# EAGLE design Nav (EAGLE 9.6.2)
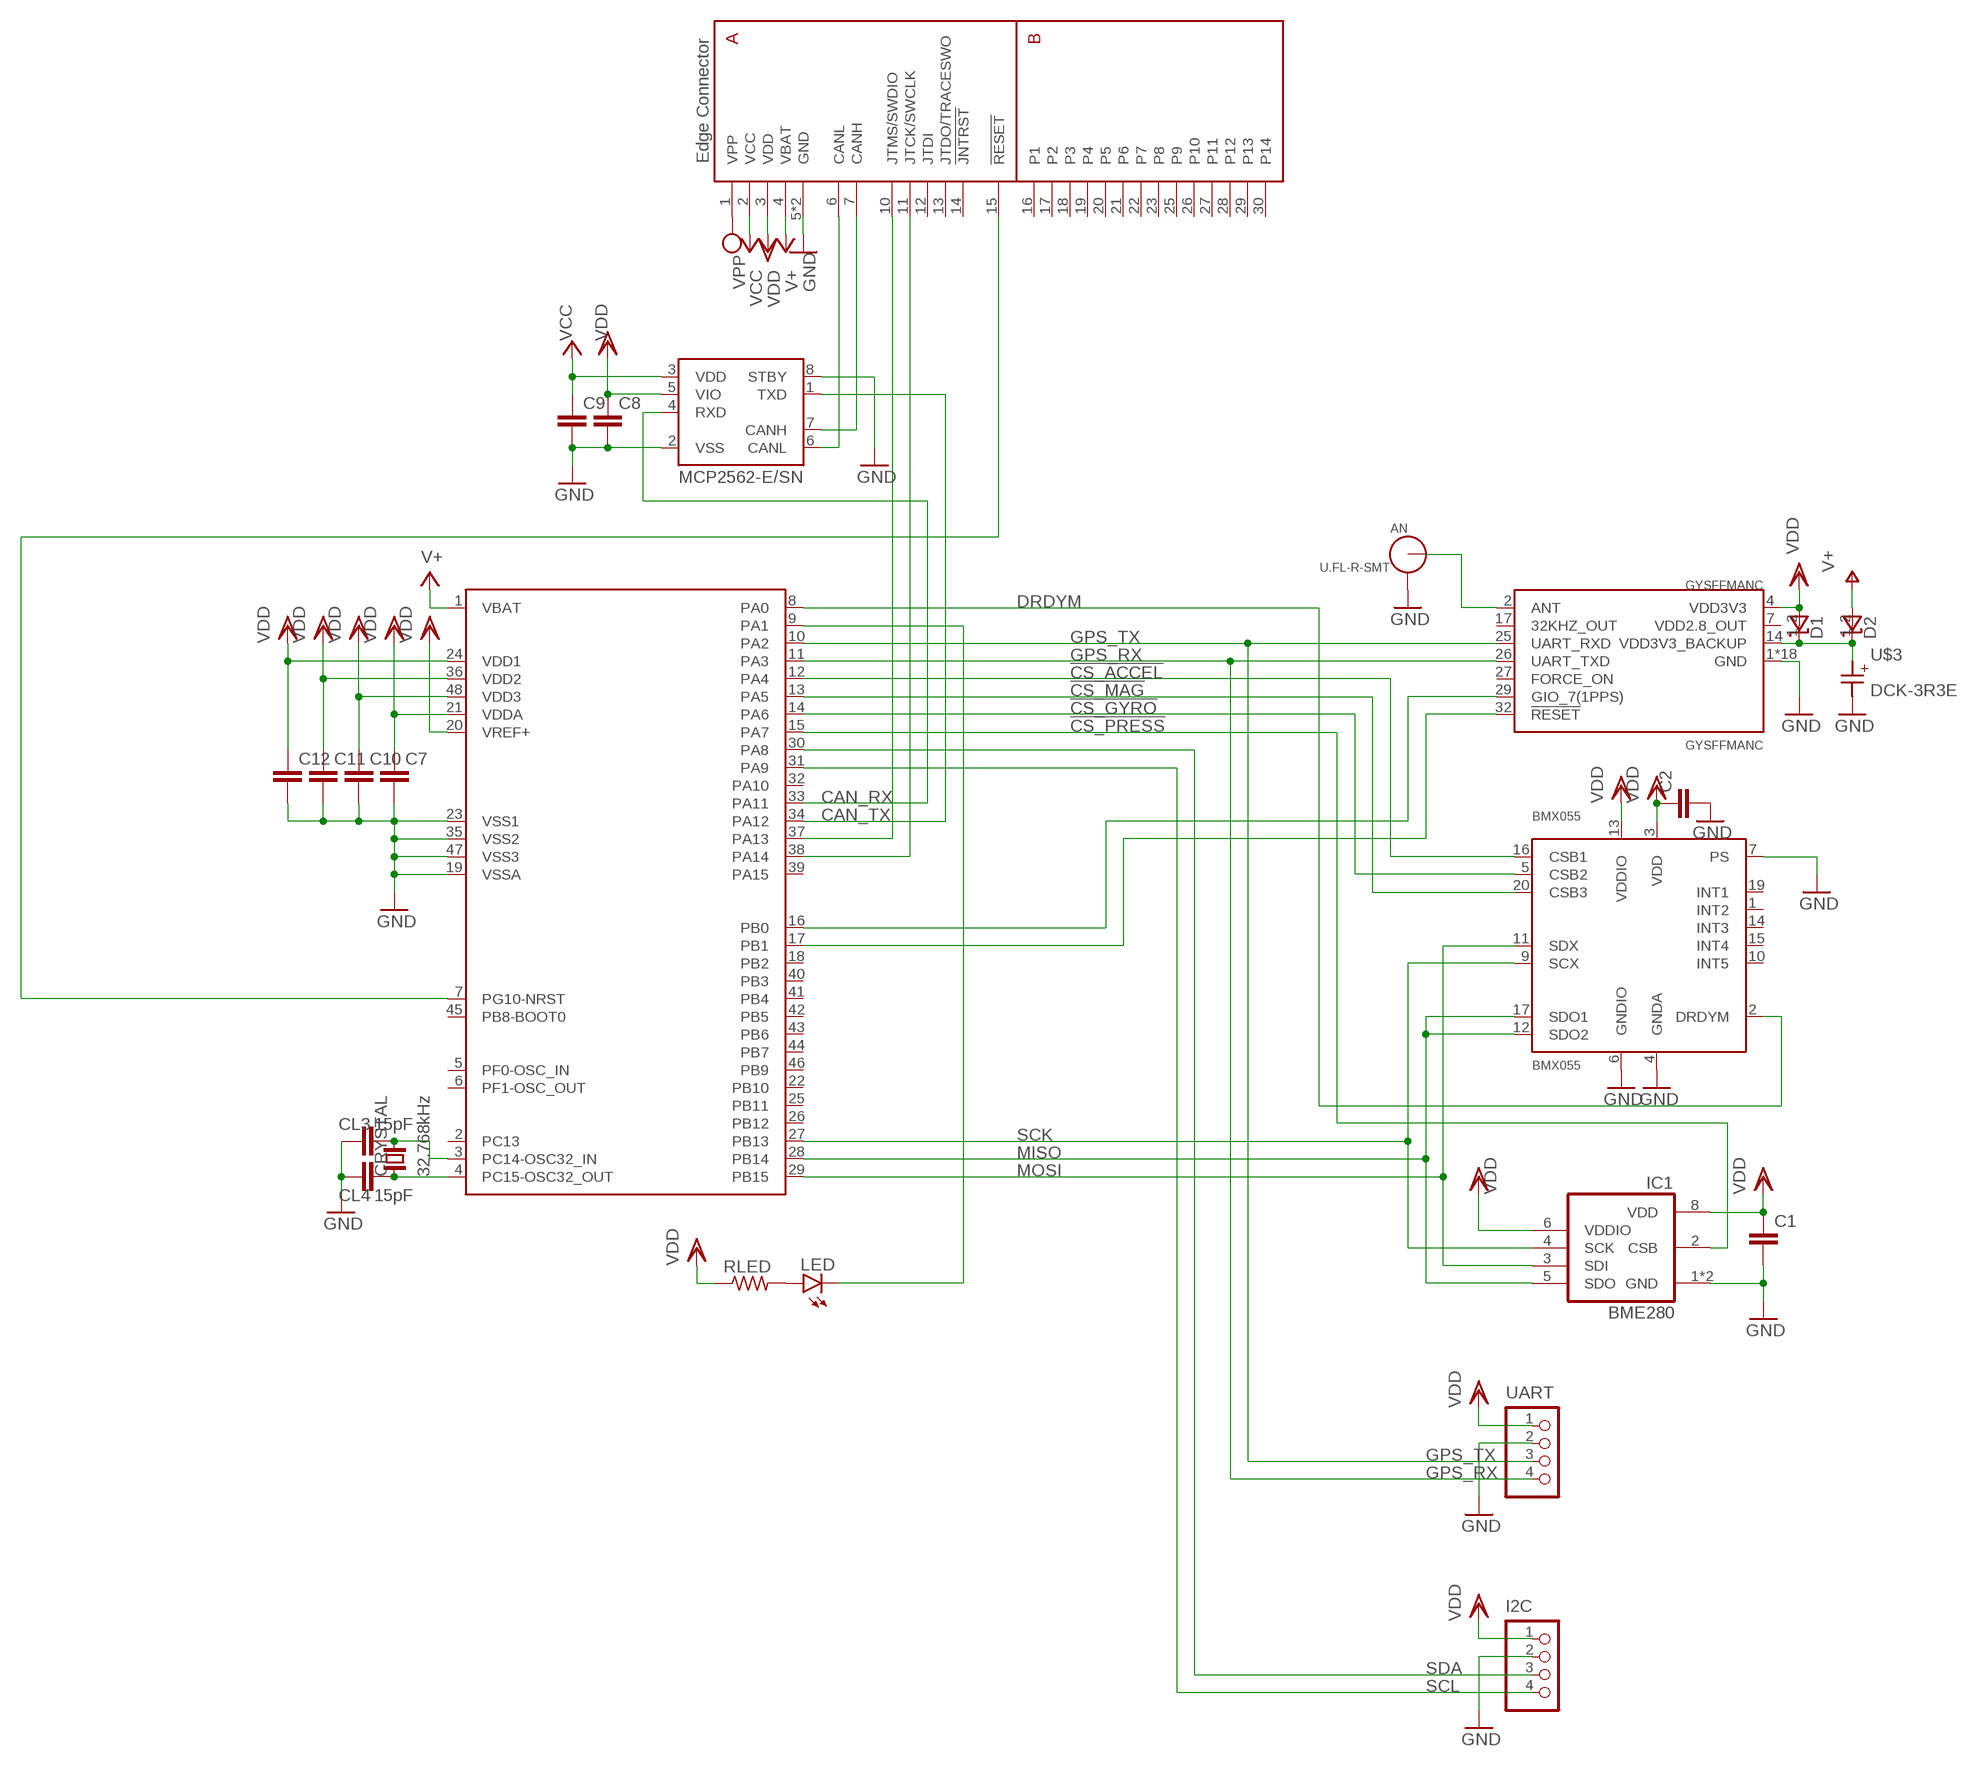
[diagram p0: schematic, sheet 1]

## Parts
AN  U.FL-R-SMT  [U.FL_SMT]
BMX055  BMX055  [BMX055]
C1  C-EUC0603K  [C0603K]
C2  C-EUC0603K  [C0603K]
C7  C-EUC0603K  [C0603K]
C8  C-EUC0603K  [C0603K]
C9  C-EUC0603K  [C0603K]
C10  C-EUC0603K  [C0603K]
C11  C-EUC0603K  [C0603K]
C12  C-EUC0603K  [C0603K]
CL3  15pF  C-EUC0603K  [C0603K]
CL4  15pF  C-EUC0603K  [C0603K]
CRYSTAL  32.768kHz  CRYTALFC-255  [FC-255]
D1  RB521S-30TE61  [SODFL1608X70N]
D2  RB521S-30TE61  [SODFL1608X70N]
GYSFFMANC  GYSFFMANC  [GYSFFMANC]
I2C  S4B-PH-K-S  [S4B-PH-K-S]
IC1  BME280  [BME280]
LED  LEDCHIP-LED0603  [CHIP-LED0603]
MCP2562  MCP2562-E/SN  [SOIC127P600X175-8N]
RLED  R-US_R0603  [R0603]
U$1  STM32G431-LQFP48  [LQFP48]
U$2  EDGE30  [EDGE30]
U$3  DCK-3R3E  [DC,DCK]
UART  S4B-PH-K-S  [S4B-PH-K-S]

## Nets
!CS_ACCEL!: BMX055.16(CSB1) U$1.12(PA4)
!CS_GYRO!: BMX055.5(CSB2) U$1.14(PA6)
!CS_MAG!: BMX055.20(CSB3) U$1.13(PA5)
!CS_PRESS!: IC1.2(CSB) U$1.15(PA7)
CAN_RX: MCP2562.4(RXD) U$1.33(PA11)
CAN_TX: MCP2562.1(TXD) U$1.34(PA12)
CANH1: MCP2562.7(CANH) U$2.7(CANH)
CANL1: MCP2562.6(CANL) U$2.6(CANL)
DRDYM: BMX055.2(DRDYM) U$1.8(PA0)
GND: AN.GND1 AN.GND2 BMX055.4(GNDA) BMX055.6(GNDIO) BMX055.7(PS) C1.2 C2.2 C7.2 C8.2 C9.2 C10.2 C11.2 C12.2 CL3.1 CL4.1 GYSFFMANC.1(GND) GYSFFMANC.3(GND) GYSFFMANC.8(GND) GYSFFMANC.10(GND) GYSFFMANC.12(GND) GYSFFMANC.22(GND) GYSFFMANC.33(GND) GYSFFMANC.36(GND) GYSFFMANC.37(GND) GYSFFMANC.38(GND) GYSFFMANC.39(GND) GYSFFMANC.40(GND) GYSFFMANC.41(GND) GYSFFMANC.42(GND) GYSFFMANC.43(GND) GYSFFMANC.44(GND) GYSFFMANC.45(GND) GYSFFMANC.46(GND) I2C.2 IC1.1(GND) IC1.7(GND) MCP2562.2(VSS) MCP2562.8(STBY) U$1.19(VSSA) U$1.23(VSS1) U$1.35(VSS2) U$1.47(VSS3) U$2.5(GND) U$2.8(GND) U$3.- UART.2
GPS_RX: GYSFFMANC.26(UART_TXD) U$1.11(PA3) UART.4
GPS_TX: GYSFFMANC.25(UART_RXD) U$1.10(PA2) UART.3
MISO: BMX055.12(SDO2) BMX055.17(SDO1) IC1.5(SDO) U$1.28(PB14)
MOSI: BMX055.11(SDX) IC1.3(SDI) U$1.29(PB15)
N$1: AN.SIG(ANT) GYSFFMANC.2(ANT)
N$2: GYSFFMANC.29(GIO_7(1PPS)) U$1.16(PB0)
N$3: GYSFFMANC.32(!RESET!) U$1.17(PB1)
N$4: U$1.7(PG10-NRST) U$2.15(!RESET!)
N$51: LED.C U$1.9(PA1)
N$70: CL4.2 CRYSTAL.1 U$1.4(PC15-OSC32_OUT)
N$71: CL3.2 CRYSTAL.2 U$1.3(PC14-OSC32_IN)
N$74: LED.A RLED.2
SCK: BMX055.9(SCX) IC1.4(SCK) U$1.27(PB13)
SCL: I2C.4 U$1.31(PA9)
SDA: I2C.3 U$1.30(PA8)
SWCLK1: U$1.38(PA14) U$2.11(JTCK/SWCLK)
SWDIO1: U$1.37(PA13) U$2.10(JTMS/SWDIO)
VBACKUP: D1.1(K) D2.1(K) GYSFFMANC.14(VDD3V3_BACKUP) U$3.+
VBAT: D2.2(A) U$1.1(VBAT) U$2.4(VBAT) ; supply symbol labelled V+
VCC: C9.1 MCP2562.3(VDD) U$2.2(VCC)
VDD: BMX055.3(VDD) BMX055.13(VDDIO) C1.1 C2.1 C7.1 C8.1 C10.1 C11.1 C12.1 D1.2(A) GYSFFMANC.4(VDD3V3) I2C.1 IC1.6(VDDIO) IC1.8(VDD) MCP2562.5(VIO) RLED.1 U$1.20(VREF+) U$1.21(VDDA) U$1.24(VDD1) U$1.36(VDD2) U$1.48(VDD3) U$2.3(VDD) UART.1
VPP: U$2.1(VPP)
Unconnected: BMX055.1(INT2) BMX055.10(INT5) BMX055.14(INT3) BMX055.15(INT4) BMX055.19(INT1) GYSFFMANC.17(32KHZ_OUT) GYSFFMANC.27(FORCE_ON) U$1.2(PC13) U$1.5(PF0-OSC_IN) U$1.6(PF1-OSC_OUT) U$1.18(PB2) U$1.22(PB10) U$1.25(PB11) U$1.26(PB12) U$1.32(PA10) U$1.39(PA15) U$1.40(PB3) U$1.41(PB4) U$1.42(PB5) U$1.43(PB6) U$1.44(PB7) U$1.45(PB8-BOOT0) U$1.46(PB9) U$2.12(JTDI) U$2.13(JTDO/TRACESWO) U$2.14(!JNTRST!) U$2.16(P1) U$2.17(P2) U$2.18(P3) U$2.19(P4) U$2.20(P5) U$2.21(P6) U$2.22(P7) U$2.23(P8) U$2.25(P9) U$2.26(P10) U$2.27(P11) U$2.28(P12) U$2.29(P13) U$2.30(P14)

## Power pins joined to a net without a drawn wire
VDD2.8_OUT: GYSFFMANC.7(VDD2.8_OUT)

## Library data of the parts
AN = connector:U.FL-R-SMT: U.FL-R-SMT Antenna Connector; DIGIKEY: H122041-ND; MANUFACTURER: Hirose; MPN: U.FL-R-SMT-1(01)
BMX055 = BMX055:BMX055: BMX055 Small, versatile 9 - axis sensor module; DIGI-KEY_PART_NUMBER: 828-1060-1-ND; DIGI-KEY_PURCHASE_URL: https://www.digikey.jp/product-detail/en/bosch-sensortec/BMX055/828-1060-1-ND/6136311?utm_source=snapeda&utm_medium=aggregator&utm_campaign=symbol; MF: Bosch Sensortec; MP: BMX055; PACKAGE: LGA-20 Bosch
C1 C2 C7-C12 CL3 CL4 = rcl:C-EU: CAPACITOR, European symbol; SPICEPREFIX: C
CRYSTAL = crystal':CRYTAL: CRYSTAL
D1 D2 = RB521S-30TE61:RB521S-30TE61: ROHM - RB521S-30TE61 - DIODE, SCHOTTKY, SMD Source: Datasheet <https://componentsearchengine.com/Datasheets/2/RB521S-30TE61.pdf>; DESCRIPTION: ROHM - RB521S-30TE61 - DIODE, SCHOTTKY, SMD; HEIGHT: 0.7mm; MANUFACTURER_NAME: ROHM Semiconductor; MANUFACTURER_PART_NUMBER: RB521S-30TE61; MOUSER_PART_NUMBER: 755-RB521S-30TE61; MOUSER_PRICE-STOCK: https://www.mouser.com/Search/Refine.aspx?Keyword=755-RB521S-30TE61; RS_PART_NUMBER: 0178677; RS_PRICE-STOCK: http://uk.rs-online.com/web/p/products/0178677
GYSFFMANC = gps:GYSFFMANC
I2C UART = jst-ph:S4B-PH-*: Wire-to-Board 2.0mm pitch side mount connector Source: http://www.jst-mfg.com/product/pdf/jpn/PH.pdf http://www.jst-mfg.com/product/detail.php?series=199
IC1 = bosch-bme280:BME280: DIGITAL HUMIDITY, PRESSURE AND TEMPERATURE SENSOR * Digital interface I²C (up to 3.4 MHz) and SPI (3 and 4 wire, up to 10 MHz)* Supply voltage VDD main supply voltage range: 1.71 V to 3.6 V*VDDIO interface voltage range: 1.2 V to 3.6 V Operating range -40…+85 °C, 0…100 % rel. humidity, 300…1100 hPa The library has been designed by Richard Magdycz <https://www.facebook.com/groups/eaglecadsoftUK>
LED = led:LED: LED OSRAM: - CHIPLED LG R971, LG N971, LY N971, LG Q971, LY Q971, LO R971, LY R971 LH N974, LH R974 LS Q976, LO Q976, LY Q976 LO Q996 - Hyper CHIPLED LW Q18S LB Q993, LB Q99A, LB R99A - SideLED LS A670, LO A670, LY A670, LG A670, LP A670 LB A673, LV A673, LT A673, LW A673 LH A674 LY A675 LS A676, LA A676, LO A676, LY A676, LW A676 LS A679, LY A679, LG A679 - Hyper Micro SIDELED® LS Y876, LA Y876, LO Y876, LY Y876 LT Y87S - SmartLED LW L88C, LW L88S LB L89C, LB L89S, LG L890 LS L89K, LO L89K, LY L89K LS L896, LA L896, LO L896, LY L896 - TOPLED LS T670, LO T670, LY T670, LG T670, LP T670 LSG T670, LSP T670, LSY T670, LOP T670, LYG T670 LG T671, LOG T671, LSG T671 LB T673, LV T673, LT T673, LW T673 LH T674 LS T676, LA T676, LO T676, LY T676, LB T676, LH T676, LSB T676, LW T676 LB T67C, LV T67C, LT T67C, LS T67K, LO T67K, LY T67K, LW E67C LS E67B, LA E67B, LO E67B, LY E67B, LB E67C, LV E67C, LT E67C LW T67C LS T679, LY T679, LG T679 LS T770, LO T770, LY T770, LG T770, LP T770 LB T773, LV T773, LT T773, LW T773 LH T774 LS E675, LA E675, LY E675, LS T675 LS T776, LA T776, LO T776, LY T776, LB T776 LHGB T686 LT T68C, LB T68C - Hyper Mini TOPLED® LB M676 - Mini TOPLED Santana® LG M470 LS M47K, LO M47K, LY M47K Source: http://www.osram.convergy.de LUXEON: - LUMILED® LXK2-PW12-R00, LXK2-PW12-S00, LXK2-PW14-U00, LXK2-PW14-V00 LXK2-PM12-R00, LXK2-PM12-S00, LXK2-PM14-U00 LXK2-PE12-Q00, LXK2-PE12-R00, LXK2-PE12-S00, LXK2-PE14-T00, LXK2-PE14-U00 LXK2-PB12-K00, LXK2-PB12-L00, LXK2-PB12-M00, LXK2-PB14-N00, LXK2-PB14-P00, LXK2-PB14-Q00 LXK2-PR12-L00, LXK2-PR12-M00, LXK2-PR14-Q00, LXK2-PR14-R00 LXK2-PD12-Q00, LXK2-PD12-R00, LXK2-PD12-S00 LXK2-PH12-R00, LXK2-PH12-S00 LXK2-PL12-P00, LXK2-PL12-Q00, LXK2-PL12-R00 Source: www.luxeon.com KINGBRIGHT: KA-3528ASYC Source: www.kingbright.com
MCP2562 = mcp2562-E_SN:MCP2562-E/SN: MCP2562 Series 5 V Surface Mount High-Speed CAN Transceiver - SOIC-8; AVAILABILITY: Unavailable; DESCRIPTION: Microchip MCP2562-E/SN, CAN Transceiver 1MBps 1-channel IEC 61000-4-2, 8-Pin SOIC; MF: Microchip; MP: MCP2562-E/SN; PACKAGE: SO-8 Microchip; PRICE: None
RLED = rcl:R-US_: RESISTOR, American symbol; SPICEPREFIX: R
U$1 = stm32g4:STM32G431-LQFP48
U$2 = bus:EDGE30
U$3 = capacitors:DCK-3R3E

## Board
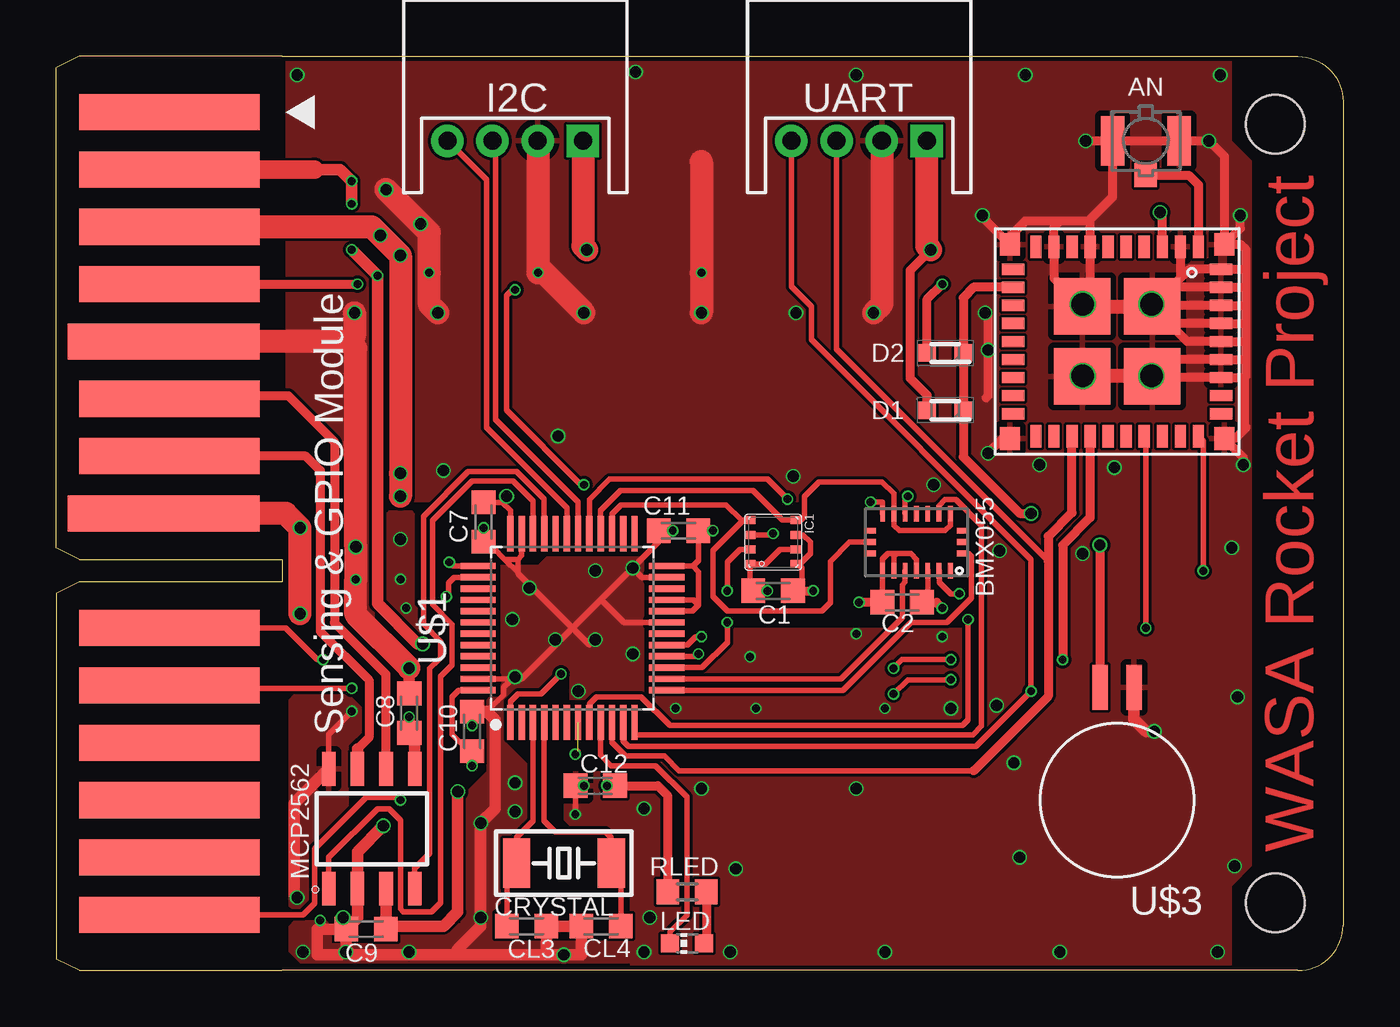
[diagram p1: board, top side]
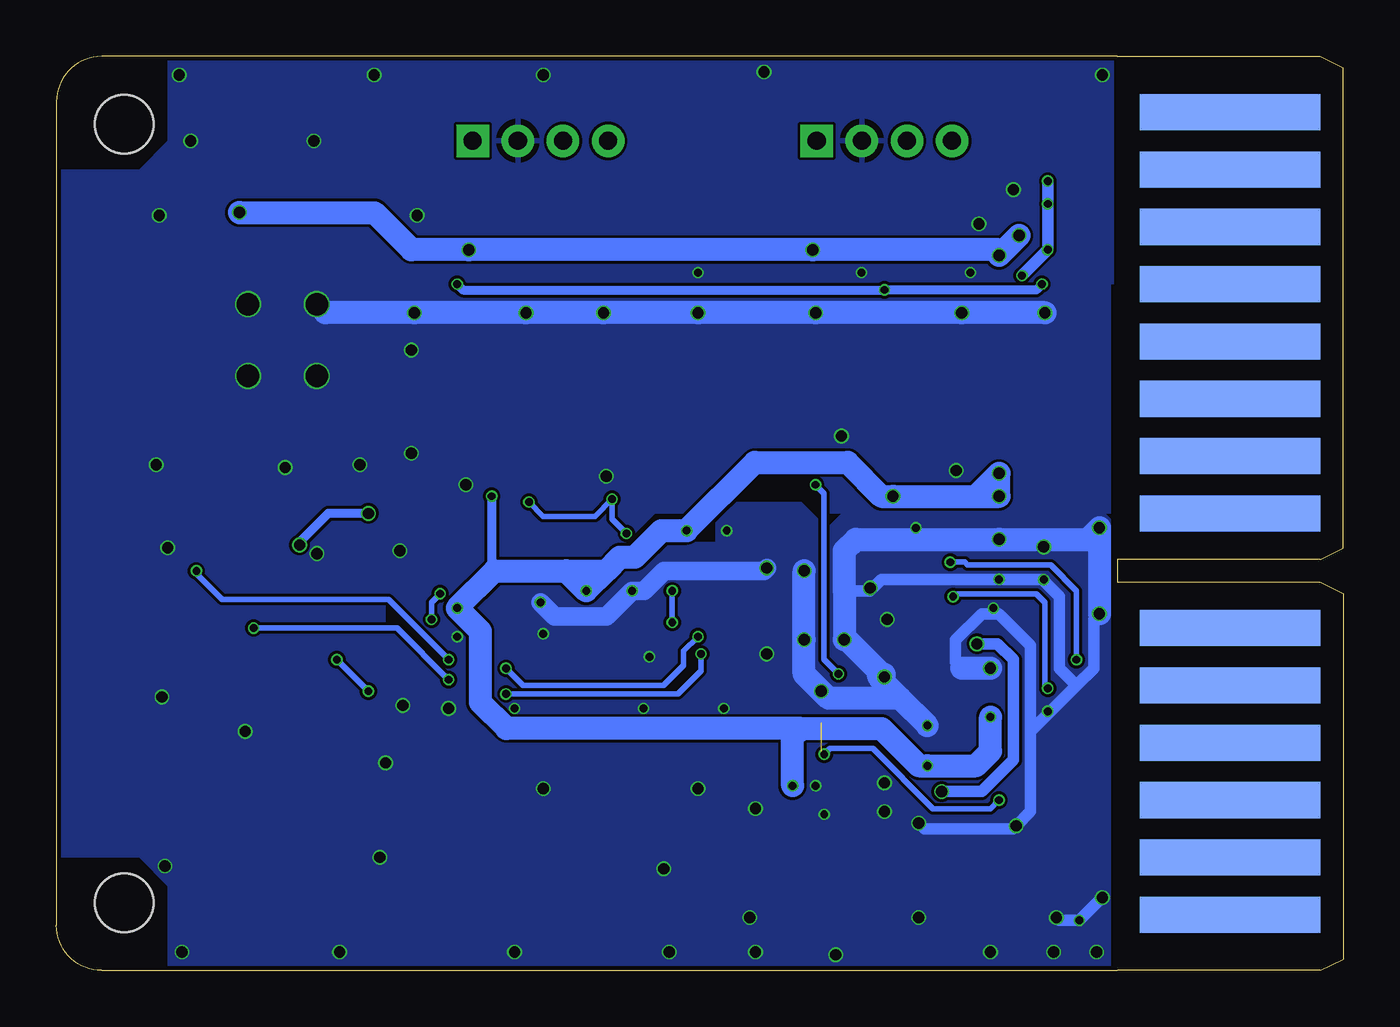
[diagram p2: board, bottom side, seen from below]

Size 57 x 40.5 mm. Coordinates in mm from the lower left corner, seen from the top.
Outline: 10,40.5 55,40.5 arc-90 57,38.5 57,2 arc-90 55,0 10,0
Copper layers (1*16): Top 0.035mm / dielectric 1.6mm / Bottom 0.035mm
Design rules "jlcpcb-2layers_": minimum track width 5mil, minimum drill 0.3mm, track to track 5mil, track to pad 5mil, pad to pad 5mil, via to via 5mil, smd to smd 5mil, copper to edge 0.2mm, drill to drill 6mil, minimum pad ring 10mil, minimum via ring 3mil, stop-mask expansion 4mil, vias tented up to drill 100mil, thermal gap 10mil
Holes 2.6 mm at 54,3 54,37.5

### Footprints (pad centres in the part's own frame; a part is rotated, then mirrored left to right if it is on the bottom)
U.FL_SMT = smd 1.05 x 2.2: GND1 -1.475,0; GND2 1.475,0 | smd 1 x 1.05: SIG 0,-1.525
BMX055 = smd 0.675 x 0.25: 1 1.262,1.5; 2 1.262,1; 3 1.262,0.5; 4 1.262,0; 5 1.262,-0.5; 6 1.262,-1; 7 1.262,-1.5; 11 -1.262,-1.5; 12 -1.262,-1; 13 -1.262,-0.5; 14 -1.262,0; 15 -1.262,0.5; 16 -1.262,1; 17 -1.262,1.5 | smd 0.25 x 0.55: 8 0.5,-2.05; 9 0,-2.05; 10 -0.5,-2.05; 18 -0.5,2.05; 19 0,2.05; 20 0.5,2.05
C0603K = smd 1.05 x 1.08: 1 -0.875,0; 2 0.875,0
FC-255 = smd 1.2 x 2.2: 1 -2.1,0; 2 2.1,0
SODFL1608X70N = smd 0.769 x 0.776: 1 -0.8,0; 2 0.8,0
GYSFFMANC = smd 1 x 0.9: 1 -4.3,4.75; 12 -4.3,-4.75; 22 4.3,-4.75; 33 4.3,4.75 | smd 1 x 0.5: 2 -4.2,3.6; 3 -4.2,2.8; 4 -4.2,2; 5 -4.2,1.2; 6 -4.2,0.4; 7 -4.2,-0.4; 8 -4.2,-1.2; 9 -4.2,-2; 10 -4.2,-2.8; 11 -4.2,-3.6; 23 4.2,-3.6; 24 4.2,-2.8; 25 4.2,-2; 26 4.2,-1.2; 27 4.2,-0.4; 28 4.2,0.4; 29 4.2,1.2; 30 4.2,2; 31 4.2,2.8; 32 4.2,3.6 | smd 0.5 x 1: 13 -3.2,-4.6; 14 -2.4,-4.6; 15 -1.6,-4.6; 16 -0.8,-4.6; 17 0,-4.6; 18 0.8,-4.6; 19 1.6,-4.6; 20 2.4,-4.6; 21 3.2,-4.6; 34 3.2,4.6; 35 2.4,4.6; 36 1.6,4.6; 37 0.8,4.6; 38 0,4.6; 39 -0.8,4.6; 40 -1.6,4.6; 41 -2.4,4.6; 42 -3.2,4.6 | smd 2.5 x 2.5: 43 -1.55,1.55; 44 -1.55,-1.55; 45 1.55,-1.55; 46 1.55,1.55
S4B-PH-K-S = drill 0.8 square: 1 3,0 | drill 0.8: 2 1,0; 3 -1,0; 4 -3,0
BME280 = smd 0.35 x 0.5: 1 0.975,-1.025; 2 0.325,-1.025; 3 -0.325,-1.025; 4 -0.975,-1.025; 5 -0.975,1.025; 6 -0.325,1.025; 7 0.325,1.025; 8 0.975,1.025
CHIP-LED0603 = smd 0.8 x 0.8: A 0,-0.75; C 0,0.75
SOIC127P600X175-8N = smd 1.5 x 0.6: 1 -2.65,1.905; 2 -2.65,0.635; 3 -2.65,-0.635; 4 -2.65,-1.905; 5 2.65,-1.905; 6 2.65,-0.635; 7 2.65,0.635; 8 2.65,1.905
R0603 = smd 1 x 1.1: 1 -0.85,0; 2 0.85,0
LQFP48 = smd 1.559 x 0.28: 1 -4.178,2.75; 2 -4.178,2.25; 3 -4.178,1.75; 4 -4.178,1.25; 5 -4.178,0.75; 6 -4.178,0.25; 7 -4.178,-0.25; 8 -4.178,-0.75; 9 -4.178,-1.25; 10 -4.178,-1.75; 11 -4.178,-2.25; 12 -4.178,-2.75; 25 4.178,-2.75; 26 4.178,-2.25; 27 4.178,-1.75; 28 4.178,-1.25; 29 4.178,-0.75; 30 4.178,-0.25; 31 4.178,0.25; 32 4.178,0.75; 33 4.178,1.25; 34 4.178,1.75; 35 4.178,2.25; 36 4.178,2.75 | smd 0.28 x 1.559: 13 -2.75,-4.178; 14 -2.25,-4.178; 15 -1.75,-4.178; 16 -1.25,-4.178; 17 -0.75,-4.178; 18 -0.25,-4.178; 19 0.25,-4.178; 20 0.75,-4.178; 21 1.25,-4.178; 22 1.75,-4.178; 23 2.25,-4.178; 24 2.75,-4.178; 37 2.75,4.178; 38 2.25,4.178; 39 1.75,4.178; 40 1.25,4.178; 41 0.75,4.178; 42 0.25,4.178; 43 -0.25,4.178; 44 -0.75,4.178; 45 -1.25,4.178; 46 -1.75,4.178; 47 -2.25,4.178; 48 -2.75,4.178
EDGE30 = smd 1.6 x 8: 1 -17.78,-5; 2 -15.24,-5; 3 -12.7,-5; 4 -10.16,-5; 6 -5.08,-5; 7 -2.54,-5; 10 5.08,-5; 11 7.62,-5; 12 10.16,-5; 13 12.7,-5; 14 15.24,-5; 15 17.78,-5 | smd 1.6 x 8.5: 5 -7.62,-5.25; 8 0,-5.25 | smd 1.6 x 8 bottom: 16 -17.78,-5; 17 -15.24,-5; 18 -12.7,-5; 19 -10.16,-5; 20 -7.62,-5; 21 -5.08,-5; 22 -2.54,-5; 23 0,-5; 25 5.08,-5; 26 7.62,-5; 27 10.16,-5; 28 12.7,-5; 29 15.24,-5; 30 17.78,-5
DC,DCK = smd 0.7 x 2: + 0.75,-5; - -0.75,-5

### Placement (x,y rotation side)
AN  48.26,36.76 0 top
BMX055  38.1,18.98 270 top
C1  31.75,16.82 180 top
C2  37.47,16.31 180 top
C7  18.92,19.87 270 top
C8  15.63,11.41 90 top
C9  13.72,1.84 180 top
C10  18.41,10.6 90 top
C11  27.56,19.49 180 top
C12  23.88,8.19 180 top
CL3  20.83,1.96 180 top
CL4  24.13,1.96 0 top
CRYSTAL  22.48,4.76 180 top
D1  39.37,24.82 180 top
D2  39.37,27.36 180 top
GYSFFMANC  46.99,27.87 270 top
I2C  20.32,36.76 0 top
IC1  31.75,18.98 270 top
LED  27.94,1.2 90 top
MCP2562  13.97,6.28 90 top
RLED  27.94,3.49 0 top
U$1  22.86,15.17 90 top
U$2  10,20.25 270 top
U$3  46.99,7.55 180 top
UART  35.56,36.76 0 top

### Tracks (layer width: path | path; a pad name or v marks a point on that pad's centre or on a via)
!CS_ACCEL!
  Top 0.254: BMX055.16 39.1,20.59 39.37,20.86 39.84,20.86 40.98,19.72 40.98,10.84 40.59,10.45 25.7,10.45 25.61,10.53 U$1.12
!CS_GYRO!
  Top 0.254: BMX055.5 37.6,17.21 37.47,17.08 37.47,15.65 34.74,12.92 U$1.14
!CS_MAG!
  Top 0.254: BMX055.20 40.4,18.48 40.53,18.35 40.53,16.51 39.45,15.42 37.85,15.42 34.84,12.42 U$1.13
!CS_PRESS!  (via drill 0.35)
  Top 0.254: v29.72,16.82 29.72,18.09 30.28,18.66 IC1.2 | v29.72,15.42 29.72,14.54 28.6,13.42 U$1.15
  Bottom 0.254: v29.72,16.82 v29.72,15.42
CAN_RX
  Top 0.254: MCP2562.4 15.88,4.52 16.54,5.18 16.54,13.38 16.95,13.79 17.03,13.87 17.03,14.58 16.26,15.35 16.26,20.11 18.24,22.1 20.39,22.1 21.61,20.88 U$1.33
CAN_TX
  Top 0.254: MCP2562.1 12.06,5.01 14.22,7.17 14.73,7.17 15.24,6.66 15.24,2.72 15.37,2.6 16.61,2.6 17.02,3 17.02,13.03 17.53,13.55 17.53,15.34 16.66,16.21 16.66,19.95 18.41,21.69 20.22,21.69 21.11,20.8 U$1.34
CANH1
  Top 0.406: 13.34,9.82 13.84,10.33 13.84,12.87 11.68,15.03 11.68,22.16 11.05,22.79 U$2.7
  Top 0.508: MCP2562.7 13.34,9.82
CANL1
  Top 0.406: MCP2562.6 14.61,13.12 12.32,15.41 12.32,23.43 10.29,25.46 5.13,25.46 U$2.6
DRDYM  (via drill 0.35)
  Top 0.254: BMX055.2 39.12,17.7 39.12,17.2 39.62,16.69 v40.01,16.69 | U$1.8 23.61,11.81 23.93,12.12 25.91,12.12 27.18,10.85 40.13,10.85 40.39,11.11 v40.39,15.55
  Bottom 0.254: v40.01,16.69 40.39,16.31 v40.39,15.55
GND  (via drill 0.35, 0.5, 1)
  Top 0.254: 20.45,18.22 20.61,18.38 U$1.35 | 20.45,17.63 20.45,18.22 | 20.19,12.92 20.61,12.92 22.86,15.17 | 22.86,15.17 20.45,17.58 20.45,17.63 | 23.61,14.42 22.86,15.17 | 22.86,15.17 24.13,16.44 | 24.13,16.44 v25.53,17.84 | 19.16,11.47 19.06,11.47 19.81,12.22 19.81,12.54 20.19,12.92 | C7.2 19.18,18.74 19.34,18.74 19.86,18.22 | 20.45,18.22 19.86,18.22 | 19.86,18.22 20.45,17.63 | v25.53,17.84 26.68,18.99 C11.2 | MCP2562.8 12.06,10.47 v13.08,11.49 | BMX055.4 38.1,18.22 37.85,18.47 37.21,18.47 | 37.21,18.47 36.83,18.47 36.6,18.24 BMX055.7 36.6,16.32 C2.2 | BMX055.6 37.1,18.36 37.21,18.47 | C12.2 23,6.93 v22.99,6.91 | U$1.47 20.19,12.92 | U$1.23 25.94,17.42 v25.53,17.84 | U$1.19 25.15,15.42 24.13,16.44 | C1.2 30.73,16.97 IC1.1 31.41,18 32.06,18.66 IC1.7
  Top 0.406: C1.2 v31.5,16.82 | C2.2 v35.56,16.31 | GYSFFMANC.3 49.79,30.67 | 49.79,30.67 49.53,30.41 | 49.53,30.41 48.9,29.77 | 48.9,29.77 GYSFFMANC.43 | 49.79,36.7 AN.GND2 | AN.GND1 AN.GND2 | AN.GND1 46.78,34.27 45.79,33.27 | 45.79,33.27 GYSFFMANC.8 45.79,29.77 GYSFFMANC.44 44.19,30.67 GYSFFMANC.10 44.19,32.94 44.45,33.2 | 45.79,33.27 45.72,33.2 44.45,33.2 | 44.45,33.2 42.93,33.2 42.24,32.52 GYSFFMANC.12 41.02,33.39 v41.02,33.46 | GYSFFMANC.1 51.82,32.25 | 49.79,30.67 50.19,31.07 GYSFFMANC.42 52.55,31.07 52.7,30.92 | 49.53,30.41 49.67,30.27 GYSFFMANC.41 52.69,30.27 52.7,30.28 | 48.9,29.77 49.2,29.47 GYSFFMANC.40 52.63,29.47 52.7,29.39 | GYSFFMANC.43 49.29,28.67 GYSFFMANC.39 52.67,28.67 52.7,28.63 | GYSFFMANC.43 50.09,27.87 GYSFFMANC.38 52.58,27.87 52.7,27.74 | 52.63,26.27 GYSFFMANC.36 48.59,26.27 GYSFFMANC.46 49.29,27.07 GYSFFMANC.37 52.67,27.07 52.7,27.11 | 52.63,26.27 52.7,26.35 52.7,27.11 | 52.7,27.11 52.7,27.74 | 52.7,27.74 52.7,28.63 | 52.7,28.63 52.7,29.39 | 52.7,29.39 52.7,30.28 | 52.7,30.28 52.7,30.92 | 52.7,30.92 52.7,31.93 52.47,32.17 GYSFFMANC.1 | 52.63,26.27 52.63,24.14 52.7,24.06 52.22,23.57 GYSFFMANC.33 52.58,22.73 v52.58,22.41 | 41.21,29.2 v41.15,29.14 41.27,29.01 v41.27,27.49 41.27,25.46 41.19,25.37 | 17.02,29.01 v16.89,29.14 | GYSFFMANC.22 41.93,23.57 v41.27,22.92 | GYSFFMANC.1 52.45,32.88 v52.45,33.46 | AN.GND2 v51.05,36.76 51.74,36.07 GYSFFMANC.1 | v45.59,36.76 AN.GND1
  Top 0.508: C9.2 13.34,2.33 MCP2562.2 13.34,5.26 v14.48,6.41 | 12.84,0.95 13.1,0.69 17.78,0.69 | C9.2 12.84,0.95 | v18.41,10.85 C10.2 19.06,11.47 19.43,11.11 19.43,7.17 v18.8,6.53 v18.8,2.34 18.8,1.96 17.78,0.95 17.78,0.69 | v15.62,13.39 v15.63,13.39 C8.2 | v18.92,19.61 C7.2 | v27.3,19.49 C11.2 | v22.48,0.69 23.25,0.69 CL4.1 CL3.1 21.7,0.69 v22.48,0.69 | 23.25,0.71 23.24,0.69 | v22.48,0.69 17.78,0.69 | C9.2 11.56,1.84 11.56,0.69 12.59,0.69 12.84,0.95 | MCP2562.8 10.54,7.41 10.54,3.36 v10.67,3.23 | U$3.- 47.74,11.12 48.26,10.6 v48.64,10.6
  Top 0.61: 48.54,26.37 v48.51,26.35 | GYSFFMANC.46 v48.51,26.35 | v48.51,26.35 v45.47,26.35 | v45.47,29.52 45.44,29.49 GYSFFMANC.44 GYSFFMANC.43
  Top 1.016: U$2.8 10.16,20.25 v10.79,19.61 v10.79,15.8 | 12.95,27.87 U$2.5 | v15.62,13.39 15.62,13.42 13.26,15.78 v13.26,17.32 v13.26,18.77 13.26,27.56 12.95,27.87 | v13.21,29.14 13.21,28.12 12.95,27.87 | 28.57,35.84 v28.57,30.92 v28.57,29.14 | v23.37,29.14 21.46,31.05 v21.34,30.92 21.34,36.74 I2C.2 | v16.89,29.14 16.51,29.52 v16.51,30.92 16.51,32.7 v16.13,33.08 v14.61,34.6 | UART.2 36.56,29.51 v36.2,29.14
  Bottom 0.508: 16.89,13.39 17.17,13.67 17.17,14.64 16,15.8 15.24,15.8 13.84,14.41 13.84,10.6 | 13.84,10.6 13.84,7.04 v14.48,6.41 14.61,6.28 18.54,6.28 v18.8,6.53 | 13.84,10.6 11.81,12.63 | 11.81,12.63 11.05,13.39 11.05,15.55 v10.79,15.8 | 11.05,19.36 v10.79,19.61 | 22.1,16.82 20.95,16.82 20.46,17.32 v13.26,17.32 13.26,17.25 12.57,16.57 12.57,13.39 11.81,12.63 | v12.7,2.34 12.57,2.22 v11.68,2.22 v10.67,3.23
  Bottom 0.813: v35.56,16.31 34.92,15.68 32.64,15.68 v31.5,16.82 30.97,16.82 30.09,17.71 25.66,17.71 v25.53,17.84
  Bottom 1.016: v15.62,13.39 16.89,13.39 | 19.62,12.06 20.57,13.01 20.57,13.14 20.32,13.14 v20.32,13.01 21.97,14.66 v22.1,14.66 22.1,16.82 22.1,18.6 21.59,19.11 v15.24,19.11 11.3,19.11 v10.79,19.61 v10.79,15.8 | 19.62,12.06 v18.41,10.85 | 19.62,12.06 22.8,12.06 v23.11,12.38 23.88,13.14 v23.88,14.66 v23.88,17.71 | v13.21,29.14 v16.89,29.14 v23.37,29.14 v28.57,29.14 v32.77,29.14 v36.2,29.14 v41.15,29.14 45.09,29.14 v45.47,29.52
  other vias: 23.37,8.19 20.32,8.31 20.32,7.04 10.92,0.82 12.83,0.82 20.95,16.95 20.19,15.55 25.53,14.03 15.62,0.82 48.51,29.52 27.43,11.61 30.73,13.9 30.99,11.61 35.43,14.92 36.7,11.61 39.24,14.79 26.04,0.82 26.29,2.34 28.57,8.06 29.84,0.82 36.7,0.82 35.43,8.06 26.04,7.17 44.45,0.82 30.1,4.5 42.67,5.01 51.44,0.82 52.2,4.63 42.42,9.2 38.86,21.52 32.64,21.9 41.66,11.74 45.47,18.47 52.07,18.73 46.86,22.28 43.56,22.41 52.32,12.12 10.67,39.68 25.65,39.81 35.43,39.68 42.93,39.68 51.56,39.68 15.49,16.06 15.24,17.33 41.78,18.6 39.62,11.61 22.23,23.68 17.14,22.16
  pour Top: 19.68,17.96 19.68,13.14 26.04,13.14 26.04,17.96
  pour Top: 19.68,13.14 19.68,12.12 20.32,12.12 20.32,12.38 21.97,12.38 21.97,13.14
  pour Top: 22.86,13.14 22.73,13.14 22.73,12.5 22.73,11.99 26.04,11.99 26.04,13.14
  pour Bottom: 23.24,17.33 23.24,20 24,20.76 27.81,20.76 27.81,12.25 26.67,11.11 20.32,11.11 18.92,9.71 16.51,9.71 16.26,9.96 16.26,20.25 22.23,20.25 22.73,19.74 22.73,13.9
  pour Bottom: 16.26,13.77 16.13,13.65 15.37,13.65 15.11,13.39 15.11,12.88 16.26,11.74
  pour Bottom: 21.4,21.46 20.07,22.79 13.08,22.79 10.29,20 10.29,13.27 12.95,10.6 14.48,10.6 14.61,10.72 14.61,14.03 15.11,14.54 16.26,14.54 16.26,16.31
  pour Bottom: 13.21,5.9 23.11,5.9 23.75,6.53 23.75,8.19 22.35,9.58 20.83,9.58 18.03,6.79 15.75,6.79 14.22,8.31 14.22,11.23 13.21,11.23
  pour Top (no thermals): 25.53,1.33 25.53,0.31 14.86,0.31 14.86,2.09 19.43,2.09 19.43,1.33
  pour Top (no thermals): 19.94,12.12 19.81,11.99 19.81,10.22 20.95,9.07 20.95,6.79 19.68,5.52 19.68,2.98 19.3,2.6 19.3,2.09 17.91,2.09 17.91,2.22 18.03,2.34 18.03,7.8 19.05,8.82 19.05,11.99 19.18,12.12
  pour Top (no thermals): 14.99,0.31 10.79,0.31 10.29,0.82 10.29,1.96 10.54,2.22 11.94,2.22 12.19,1.96 12.19,1.2 14.99,1.2
  pour Top (no thermals): 21.21,17.58 21.21,17.84 21.72,18.34 26.04,18.34 26.04,17.71 21.34,17.71
  pour Top (no thermals): 13.84,15.8 13.84,25.2 13.46,24.82 13.46,16.19
  pour Bottom: 13.46,0.31 13.46,2.22 25.53,2.22 25.53,0.31
  pour Bottom: 13.84,0.18 10.92,0.18 10.41,0.69 10.41,1.07 10.67,1.33 13.84,1.33
  pour Bottom: 11.68,1.84 13.08,1.84 13.34,2.09 13.34,2.22 13.34,2.6 13.08,2.85 12.7,2.85 11.94,2.85 10.92,3.87 10.54,3.87 10.29,3.61 10.29,2.85 11.18,1.96 11.3,1.84
  pour Top: 10.41,2.72 10.79,2.72 11.18,3.11 11.18,5.52 12.95,7.3 12.95,9.96 13.59,10.6 13.59,11.61 12.95,12.25 10.54,12.25 10.29,11.99 10.29,2.85
  pour Top: 12.83,15.8 12.83,22.66 10.29,25.2 10.29,29.77 10.54,30.03 13.84,30.03 14.1,29.77 14.1,15.17 13.46,15.17
  pour Bottom: 10.16,40.57 10.16,30.41 39.37,30.41 43.18,34.22 43.18,40.57
  pour Bottom: 43.18,40.57 52.07,40.57 52.07,36.76 53.34,35.49 57.15,35.49 57.15,5.01 53.34,5.01 52.07,3.74 52.07,-0.07 42.42,-0.07 42.42,32.19 43.18,32.95
  pour Bottom: 40.64,38.03 40.64,12.63 38.1,12.63 30.48,20.25 10.29,20.25 10.29,38.03
  pour Bottom: 22.35,29.9 22.35,28.25 13.08,28.25 12.57,28.76 12.57,29.52 12.83,29.77 13.84,29.77 14.48,30.41 22.35,30.41
  pour Bottom: 16,30.28 16,31.68 41.91,31.68 41.91,30.41 16.13,30.41
  pour Bottom: 10.29,-0.07 43.18,-0.07 43.18,11.36 36.83,17.71 32.51,17.71 31.24,18.98 15.24,18.98 10.29,14.03
  pour Bottom: 40.64,32.95 43.18,32.95 43.18,11.36 40.64,11.36
  pour Bottom: 39.37,32.95 43.18,32.95 43.18,27.87 39.37,27.87
  pour Bottom: 43.18,3.74 43.18,-0.07 12.7,-0.07 12.7,2.72 12.83,2.85 42.29,2.85
  pour Top: 10.16,40.57 10.16,25.33 14.73,20.76 39.75,20.76 52.07,33.08 52.07,40.57
  pour Top: 52.07,36.76 52.96,35.87 52.96,4.63 52.07,3.74 52.07,-0.07 41.02,-0.07 41.02,30.79 46.99,36.76
  pour Top: 41.91,18.98 39.62,21.27 39.62,23.3 38.86,24.06 38.86,30.03 41.53,30.03 41.91,29.65
  pour Top: 41.91,15.17 26.54,15.17 26.54,10.09 41.91,10.09
  pour Top: 41.91,-0.07 25.4,-0.07 25.4,6.28 22.86,6.28 22.48,6.66 22.48,8.82 24.13,8.82 25.4,10.09 41.91,10.09
  pour Top: 17.78,15.17 17.78,14.15 16.89,14.15 14.61,16.44 14.61,20.25 14.73,20.38 15.75,20.38 15.88,20.25 15.88,16.19 16.89,15.17
GPS_RX  (via drill 0.35)
  Top 0.254: U$1.11 25.11,10.18 25.35,9.93 40.74,9.93 v43.18,12.38 43.18,18.22 33.45,27.95 33.45,29.42 32.56,30.31 UART.4
  Top 0.406: 43.14,12.42 v43.18,12.38 | GYSFFMANC.26 45.79,20.07 44.58,18.85 v44.58,13.77
  Bottom 0.254: v43.18,12.38 v44.58,13.77
GPS_TX
  Top 0.254: U$1.10 24.61,10.1 25.21,9.5 26.93,9.5 27.59,8.85 40.64,8.85 | UART.3 34.56,27.52 43.94,18.14
  Top 0.406: 40.64,8.85 43.94,12.15 43.94,18.14 43.94,19.23 44.99,20.28 GYSFFMANC.25
MISO
  Top 0.254: BMX055.17 39.6,19.72 39.37,19.49 37.34,19.49 37.1,19.73 BMX055.12 37.1,21.12 36.58,21.65 33.78,21.65 33.15,21.01 33.15,20.12 32.98,19.95 IC1.5 32.17,19.95 30.86,21.27 25,21.27 24.11,20.38 U$1.28
MOSI  (via drill 0.35)
  Top 0.254: v32.38,20.89 31.5,21.77 24.51,21.77 23.61,20.87 U$1.29 | v31.75,19.36 31.69,19.3 IC1.3 | BMX055.11 36.6,20.73 36.58,20.76 v36.07,20.76
  Bottom 0.254: v31.75,19.36 32.38,20 v32.38,20.89 33.15,20.12 35.43,20.12 v36.07,20.76
N$1
  Top 0.406: AN.SIG 50.17,35.23 50.59,34.81 GYSFFMANC.2
N$2  (via drill 0.35)
  Top 0.254: U$1.16 28.34,13.92 v28.45,14.03 | v37.08,12.25 37.72,12.88 v39.62,12.88 39.75,12.88 | GYSFFMANC.29 48.26,23.6 v48.26,15.17
  Bottom 0.254: v28.45,14.03 28.45,13.27 29.46,12.25 v37.08,12.25 | v39.62,12.88 41.91,15.17 v48.26,15.17
N$3  (via drill 0.35)
  Top 0.254: U$1.17 27.95,14.42 28.32,14.79 v28.57,14.79 | v37.08,13.39 37.47,13.77 v39.62,13.77 | GYSFFMANC.32 50.8,23.46 v50.8,17.71
  Bottom 0.254: v28.57,14.79 29.21,14.15 29.21,13.52 30.1,12.63 36.32,12.63 v37.08,13.39 | v39.62,13.77 42.29,16.44 49.66,16.44 50.8,17.58 v50.8,17.71
N$4  (via drill 0.35)  (1 unrouted)
  Top 0.254: v22.99,9.58 23.11,9.71 | U$2.15 10.92,2.47 11.43,2.98 11.43,5.39 13.72,7.68 15.11,7.68 v15.24,7.55
  Bottom 0.254: v22.99,9.58 22.73,9.84 20.83,9.84 18.16,7.17 15.62,7.17 v15.24,7.55
N$51
  Top 0.254: LED.C 27.19,1.71 27.93,2.45 27.93,7.68 26.54,9.07 24.58,9.07 24.11,9.54 U$1.9
N$70
  Top 0.254: CL4.2 25,4.33 CRYSTAL.1 24.58,5.9 24.32,6.15 22.1,6.15 21.61,6.64 U$1.4
N$71
  Top 0.254: CL3.2 19.95,4.33 CRYSTAL.2 20.38,5.9 21.11,6.63 U$1.3
N$74
  Top 0.406: RLED.2 28.79,1.3 LED.A
SCK
  Top 0.254: BMX055.9 35.14,18.98 34.29,18.13 34.29,16.31 33.91,15.93 29.72,15.93 29.08,16.57 29.08,18.6 30.44,19.95 IC1.4 30.34,19.95 29.67,20.63 25.02,20.63 24.61,20.22 U$1.27
SCL
  Top 0.254: I2C.4 19.05,35.03 19.05,24.06 22.61,20.5 U$1.31
SDA
  Top 0.254: I2C.3 19.45,36.63 19.45,35.21 19.46,35.2 19.46,24.42 23.11,20.76 U$1.30
SWCLK1  (via drill 0.35)
  Top 0.254: v13.08,12.5 5.13,12.5 U$2.11 | v17.27,16.57 17.37,16.66 17.37,17.18 17.61,17.42 U$1.38
  Bottom 0.254: v17.27,16.57 17.14,16.69 13.59,16.69 13.21,16.31 13.21,12.63 v13.08,12.5
SWDIO1  (via drill 0.35)
  Top 0.254: v11.81,13.77 11.56,13.77 10.16,15.17 U$2.10 | U$1.37 17.57,17.92 v17.4,18.09
  Bottom 0.254: v11.81,13.77 11.81,16.82 12.95,17.96 16.64,17.96 16.76,18.09 v17.4,18.09
VBACKUP  (via drill 0.5)
  Top 0.406: U$3.+ 46.19,12.6 46.23,12.64 v46.23,18.85 | GYSFFMANC.14 40.63,30.27 40.17,29.81 D2.1 D1.1 40.17,22.75 42.67,20.25 v43.18,20.25
  Bottom 0.406: v43.18,20.25 44.96,20.25 46.23,18.98 v46.23,18.85
VBAT  (via drill 0.35)
  Top 0.254: v22.35,13.14 21.46,12.25 20.45,12.25 20.11,11.91 U$1.1 | v23.37,21.52 23.24,21.52 19.94,24.82 19.94,29.9 20.19,30.16 v20.32,30.16
  Top 0.406: U$2.4 v13.34,30.41 | D2.2 38.57,29.74 v39.24,30.41
  Bottom 0.254: v22.35,13.14 22.99,13.77 22.99,21.14 v23.37,21.52
  Bottom 0.406: v13.34,30.41 13.59,30.16 v20.32,30.16 38.99,30.16 v39.24,30.41
VCC  (via drill 0.35, 0.5)
  Top 0.508: MCP2562.3 14.61,1.85 C9.1 14.72,1.96 17.14,1.96 17.78,2.6 v17.78,7.93 | v16.22,14.47 16.01,14.47 14.22,16.26 v14.22,30.79 v13.08,31.93 | v13.08,33.97 v13.08,34.98 12.57,35.49 11.43,35.49
  Top 0.813: U$2.2 11.43,35.49
  Bottom 0.508: v17.78,7.93 16,7.93 14.61,9.33 14.61,13.77 15.3,14.47 v16.22,14.47 | v14.22,30.79 v13.08,31.93 v13.08,33.97 v13.08,34.98
VDD  (via drill 0.35, 0.5)
  Top 0.254: C10.1 18.27,9.72 17.53,10.47 17.53,12.12 17.82,12.42 U$1.48 | C7.1 19.74,20.74 | 19.74,20.74 20.11,20.38 U$1.36 | BMX055.3 38.6,16.57 C2.1 | C1.1 33.02,17.22 33.02,17.84 32.85,18 IC1.8 32.93,18 33.4,18.47 33.4,18.98 33.08,19.3 IC1.6 | BMX055.13 37.6,20.89 v37.72,21.01 | C11.1 28.43,18.16 28.19,17.92 | v19.94,21.01 19.94,20.94 19.74,20.74 | U$1.24 28.19,17.92 | U$1.20 28.18,15.92 28.45,16.19 | 28.45,16.19 28.45,17.67 28.19,17.92 | U$1.21 28.21,16.42 28.45,16.19
  Top 0.406: RLED.1 27.09,7.74 26.64,8.19 C12.1 | C1.1 v33.53,16.82 | C2.1 38.99,16.31 v39.24,16.06 | GYSFFMANC.4 48.99,33.49 v48.9,33.59 | D1.2 38.57,25.5 37.83,26.23 37.83,31.03 v38.73,31.93
  Top 0.508: v18.41,9.07 C10.1 | C12.1 v24.38,8.19 | v15.62,11.23 v15.63,11.23 C8.1 15.88,10.28 MCP2562.5 | v29.08,19.49 C11.1
  Top 1.016: U$2.3 13.97,32.95 v14.35,32.57 v15.24,31.68 v15.24,22.03 v15.24,21.01 | v38.73,31.93 38.56,32.11 UART.1 | I2C.1 23.32,32.11 v23.5,31.93
  Bottom 0.406: v37.72,21.01 37.72,17.84 37.59,17.71
  Bottom 1.016: v24.38,8.19 24.38,10.34 24,10.72 | 24,10.72 37.07,10.72 38.23,11.88 38.23,15.04 v39.24,16.06 37.59,17.71 34.42,17.71 | 24,10.72 20.45,10.72 18.8,9.07 v18.41,9.07 16.26,9.07 15.62,9.71 v15.62,11.23 | 16.26,21.01 v15.24,21.01 v15.24,22.03 16.26,21.01 | 16.26,21.01 v19.94,21.01 20.45,21.01 21.94,22.51 26.06,22.51 v29.08,19.49 30.2,19.49 31.37,18.32 32.03,18.32 32.64,17.71 | 34.42,17.71 v33.53,16.82 32.64,17.71 | 34.42,17.71 32.64,17.71 | v48.9,33.59 48.88,33.57 42.91,33.57 41.27,31.93 v38.73,31.93 v23.5,31.93 15.24,31.93 v15.24,31.68 v14.35,32.57

### Text on the board
Top: WASA Rocket Project
tNames: Sensing & GPIO Module
tStop: WASA Rocket Project
bStop: Designed by @fujiy0, 2019